# Altium schematic sheet MOUNTING_HOLE.SchDoc
size A3; SheetNumber: 24; SheetTotal: 24
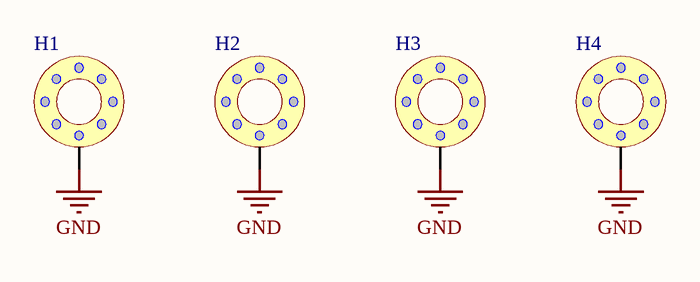
[diagram p0: MOUNTING_HOLE.SchDoc]

## Parts
H1  hole_space  [HOLE_SPACE]  (value not drawn)
H2  hole_space  [HOLE_SPACE]  (value not drawn)
H3  hole_space  [HOLE_SPACE]  (value not drawn)
H4  hole_space  [HOLE_SPACE]  (value not drawn)

## Nets
GND: H1.1 H2.1 H3.1 H4.1

## Notes on the sheet
- Project:
- Page Contents:
- Revision:
- Design:
- Date:
- Size:
- A3
- Document Number:
- Sheet:
- of